# Altium schematic sheet motor.SchDoc
size A; SheetNumber: 3; SheetTotal: 3; SPICEModelCacheKFHQGXDF: <root> / <DocumentId>KFHQGXDF</DocumentId> / </root>
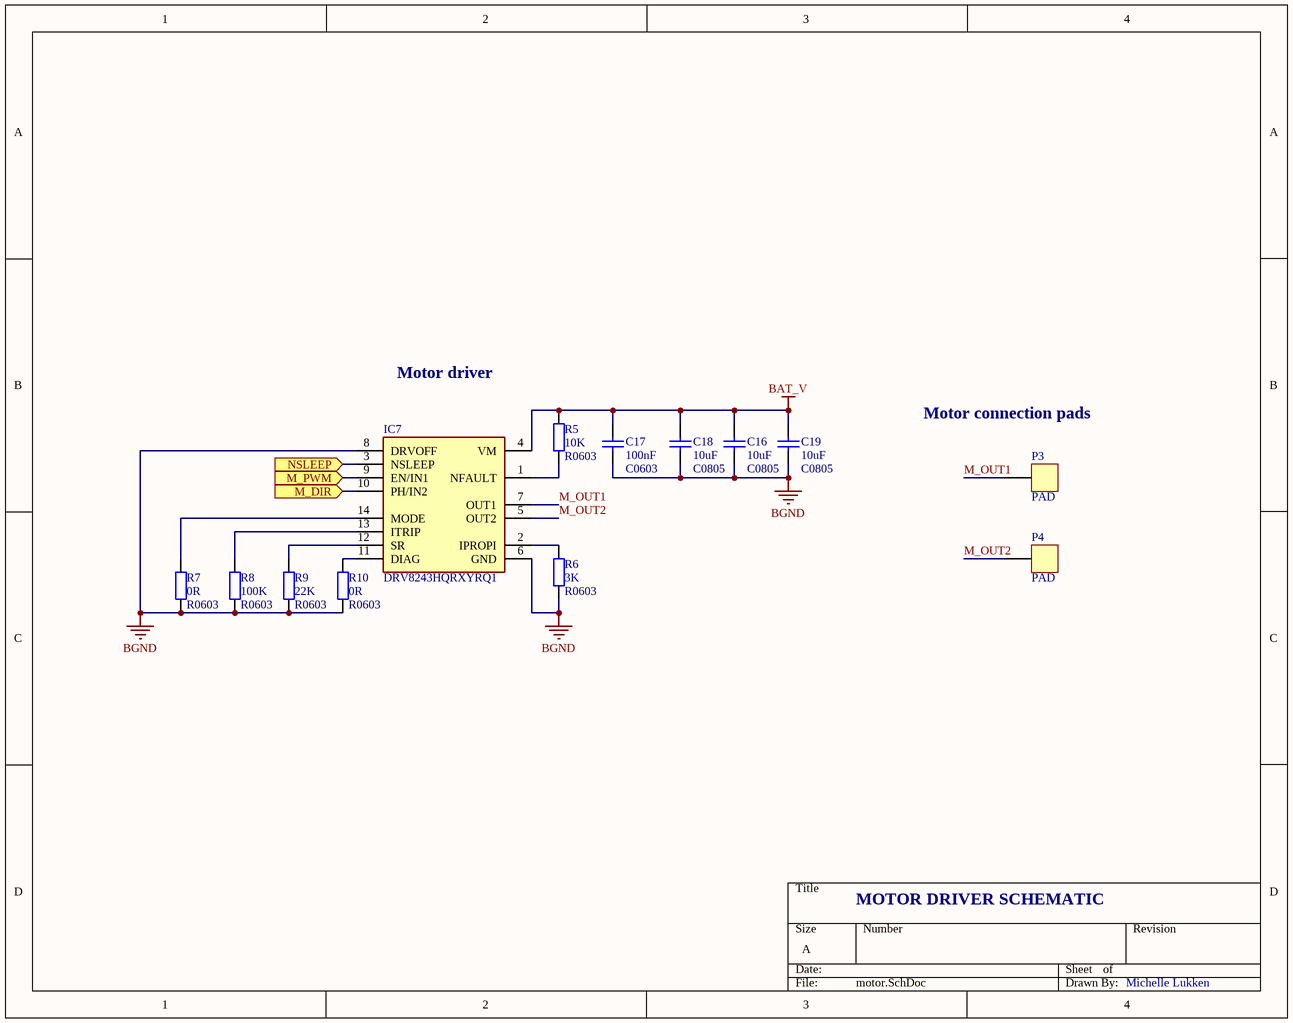
[diagram p0: motor.SchDoc]

## Parts
C16  Capacitance: 10uF  [C0805]
C17  Capacitance: 100nF  [C0603]
C18  Capacitance: 10uF  [C0805]
C19  Capacitance: 10uF  [C0805]
IC7  DRV8243HQRXYRQ1  [DRV8243HQRXYRQ1]
P3  PAD  [PAD]
P4  PAD  [PAD]
R5  10K  [R0603]
R6  3K  [R0603]
R7  0R  [R0603]
R8  100K  [R0603]
R9  22K  [R0603]
R10  0R  [R0603]

## Ports
M_DIR (in, see top_overview[6B]), M_PWM (in, see top_overview[6B]), NSLEEP (in, see top_overview[6B])

## Nets
BAT_V: C16.2 C17.2 C18.2 C19.2 IC7.4(VM) R5.2
BGND: C16.1 C17.1 C18.1 C19.1 IC7.6(GND) IC7.8(DRVOFF) R6.1 R7.1 R8.1 R9.1 R10.1
M_DIR: IC7.10(PH/IN2) ; port M_DIR
M_OUT1: IC7.7(OUT1) P3.1(PAD)
M_OUT2: IC7.5(OUT2) P4.1(PAD)
M_PWM: IC7.9(EN/IN1) ; port M_PWM
NSLEEP: IC7.3(NSLEEP) ; port NSLEEP
NetIC7_1: IC7.1(NFAULT) R5.1
NetIC7_2: IC7.2(IPROPI) R6.2
NetIC7_11: IC7.11(DIAG) R10.2
NetIC7_12: IC7.12(SR) R9.2
NetIC7_13: IC7.13(ITRIP) R8.2
NetIC7_14: IC7.14(MODE) R7.2

## Notes on the sheet
- Motor driver
- Motor connection pads
- MOTOR DRIVER SCHEMATIC
- Michelle Lukken

## Library data of the parts
C16-C19 = Capacitor: Ceramic capacitor; Type: MLCC; Voltage rating: *V; ComponentLinknDescription: Datasheet; Characteristic: *; Manufacturer: *; ComponentLinknURL: *
  C16 C18 C19: Note: C0805
  C17: Note: C0603
IC7 = DRV8243HQRXYRQ1: Integrated Circuit; Manufacturer_Name: Texas Instruments; Datasheet Link: https://www.ti.com/lit/ds/symlink/drv8243-q1.pdf?HQS=dis-mous-null-mousermode-dsf-pf-null-wwe&ts=1659353397059&ref_url=https%253A%252F%252Fwww.mouser.com%252F; Height: 1mm; Manufacturer_Part_Number: DRV8243HQRXYRQ1
R5-R10 = Resistor: Precision: *%; Voltage rating: *V; Temp coefficient: *ppm; Power rating: *mW; ComponentLinknDescription: Datasheet; Manufacturer: *; ComponentLinknURL: *; Note: R0603
  R5: Resistance: 10K
  R6: Resistance: 3K
  R7 R10: Resistance: 0R
  R8: Resistance: 100K
  R9: Resistance: 22K